# EAGLE design Clock (EAGLE 6.4)
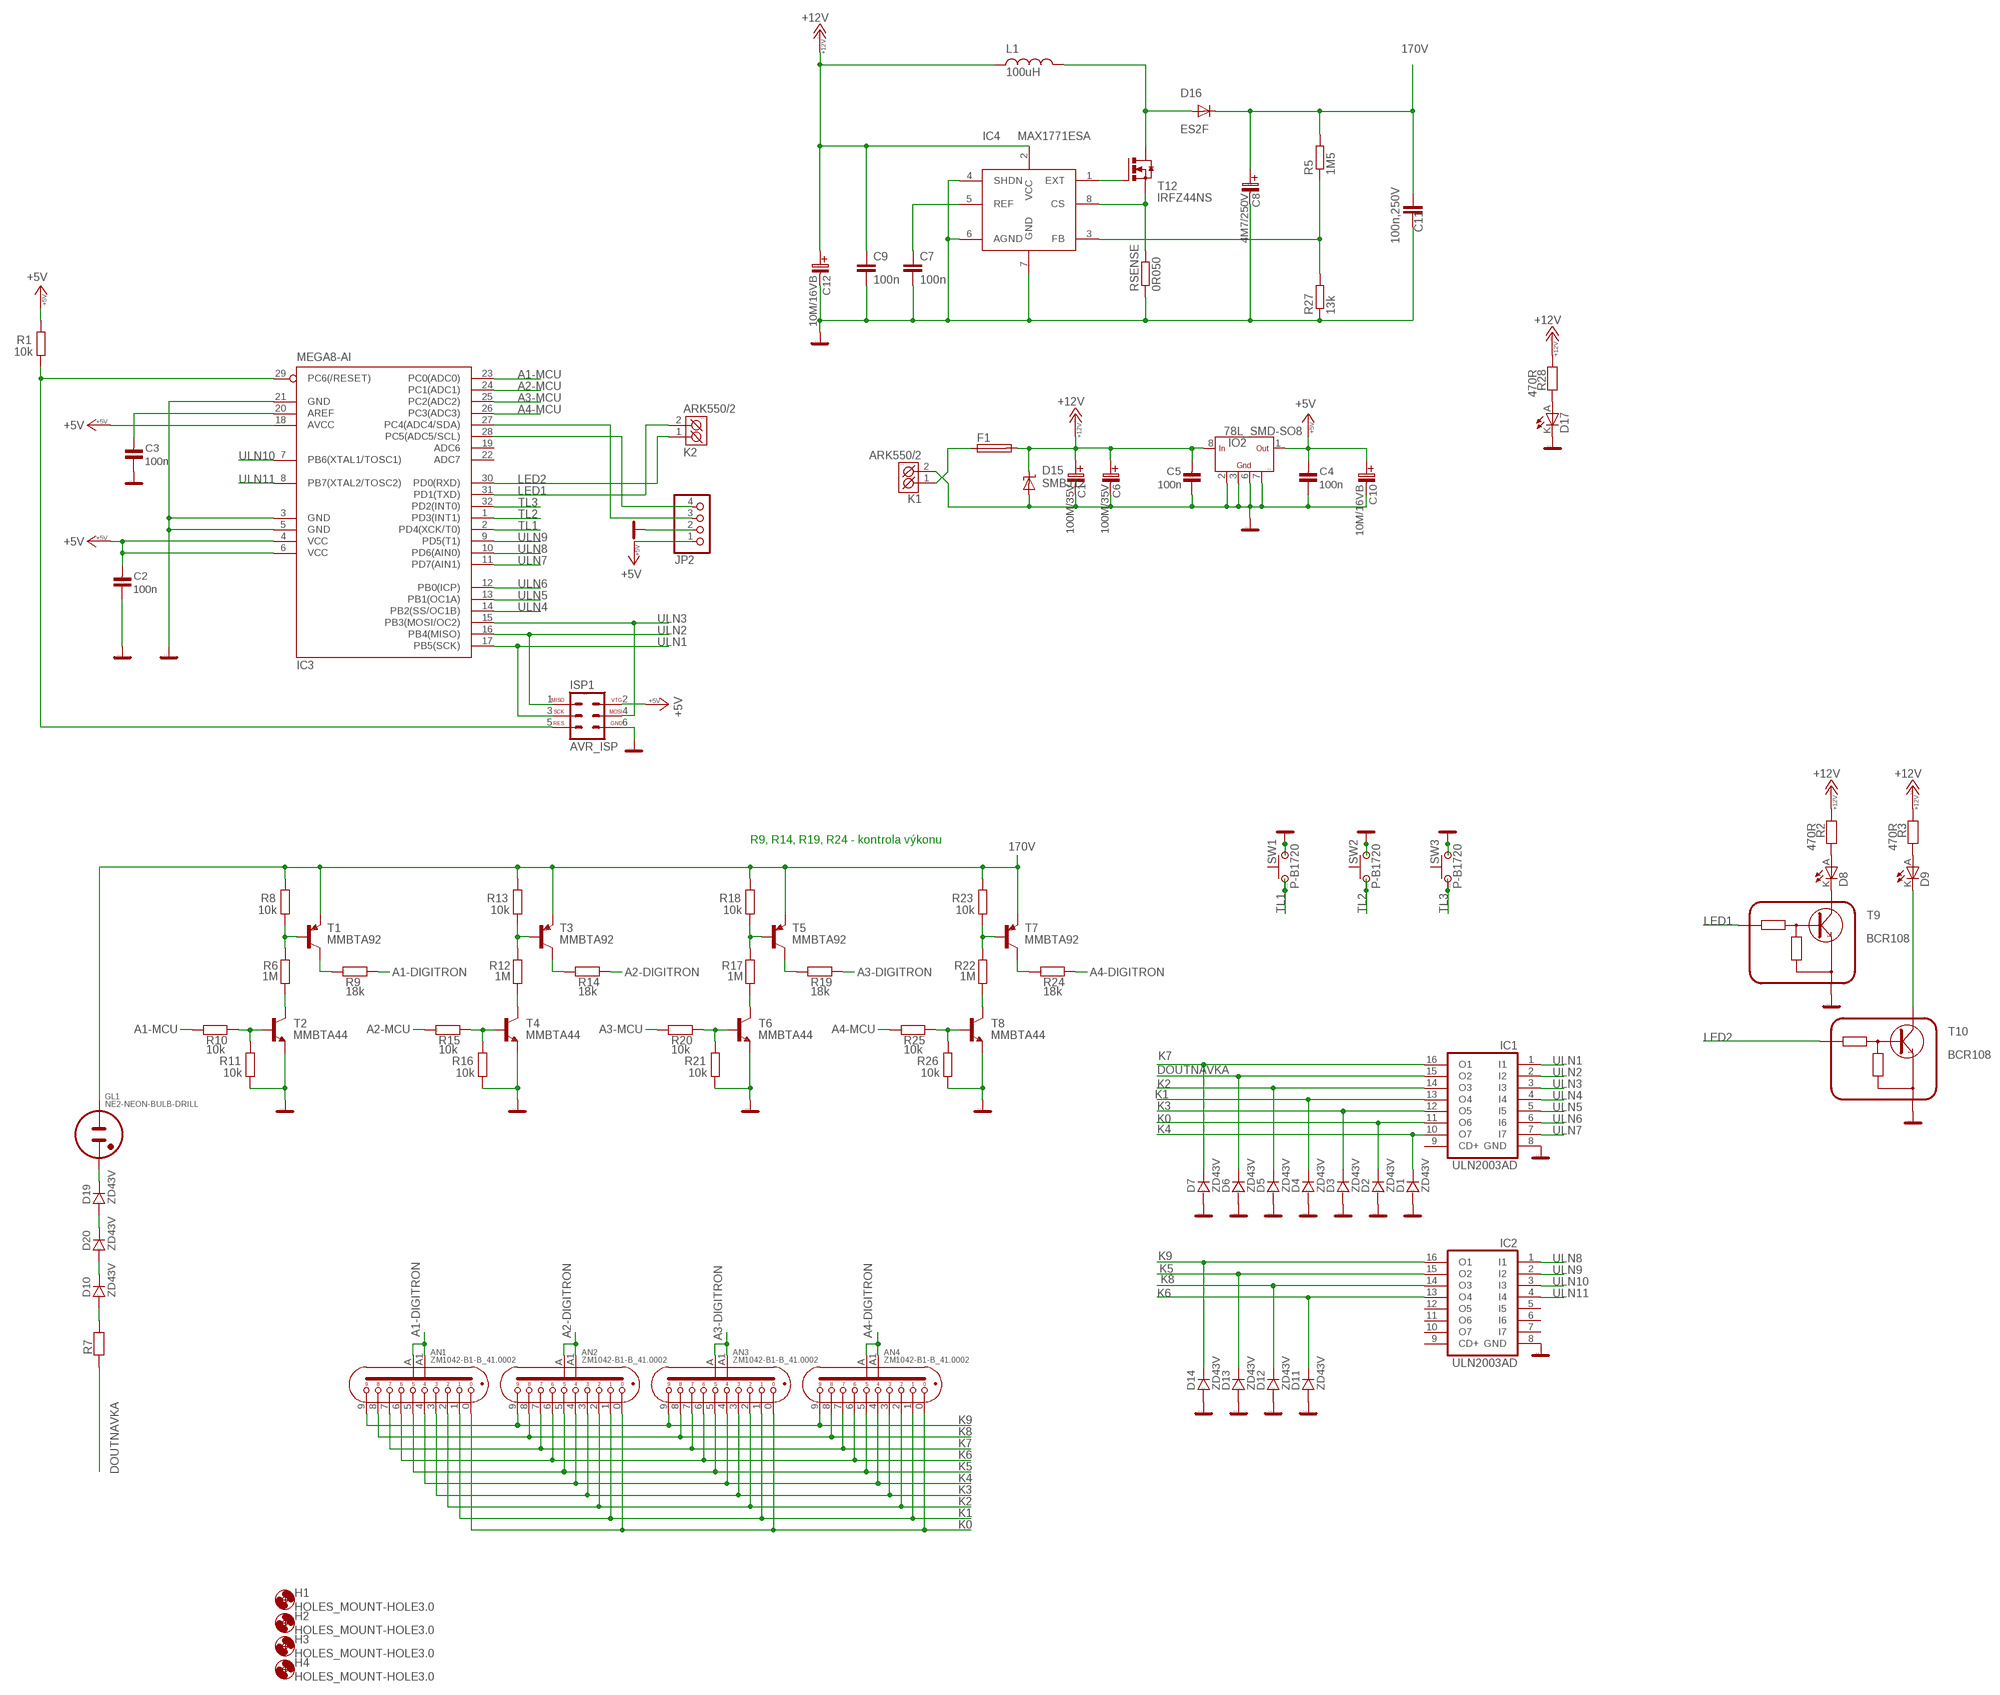
[diagram p0: schematic, sheet 1]

## Parts
AN1  ZM1042-B1-B_41.0002  [ZM1042-MULTI-CONTACT]
AN2  ZM1042-B1-B_41.0002  [ZM1042-MULTI-CONTACT]
AN3  ZM1042-B1-B_41.0002  [ZM1042-MULTI-CONTACT]
AN4  ZM1042-B1-B_41.0002  [ZM1042-MULTI-CONTACT]
C1  100M/35V  [C_EL_3,5]
C2  100n  C-KERAMIK_SMD_0805  [0805]
C3  100n  C-KERAMIK_SMD_0805  [0805]
C4  100n  C-KERAMIK_SMD_0805  [0805]
C5  100n  C-KERAMIK_SMD_0805  [0805]
C6  100M/35V  [C_EL_3,5]
C7  100n  C-EUC0805  [C0805]
C8  4M7/250V  [C_EL_3,5]
C9  100n  C-EUC0805  [C0805]
C10  10M/16VB  [B]
C11  100n,250V  C-EU-2420  [C2420]
C12  10M/16VB  [B]
D1  ZD43V  1N4148_SOD80  [SOD-80]
D2  ZD43V  1N4148_SOD80  [SOD-80]
D3  ZD43V  1N4148_SOD80  [SOD-80]
D4  ZD43V  1N4148_SOD80  [SOD-80]
D5  ZD43V  1N4148_SOD80  [SOD-80]
D6  ZD43V  1N4148_SOD80  [SOD-80]
D7  ZD43V  1N4148_SOD80  [SOD-80]
D8  LEDLED3MM  [LED3MM]
D9  LEDLED3MM  [LED3MM]
D10  ZD43V  1N4148_SOD80  [SOD-80]
D11  ZD43V  1N4148_SOD80  [SOD-80]
D12  ZD43V  1N4148_SOD80  [SOD-80]
D13  ZD43V  1N4148_SOD80  [SOD-80]
D14  ZD43V  1N4148_SOD80  [SOD-80]
D15  SMBJ12  SUPPRESSOR-SMBJ  [SMBJ]
D16  ES2F  DIODE-SMC  [SMC]
D17  LEDLED3MM  [LED3MM]
D19  ZD43V  1N4148_SOD80  [SOD-80]
D20  ZD43V  1N4148_SOD80  [SOD-80]
F1  TE5  [TE5]
GL1  NE2-NEON-BULB-DRILL  [NE2-NEON-BULB-DRILL]
H1  HOLES_MOUNT-HOLE3.0  [HOLES_3,0]
H2  HOLES_MOUNT-HOLE3.0  [HOLES_3,0]
H3  HOLES_MOUNT-HOLE3.0  [HOLES_3,0]
H4  HOLES_MOUNT-HOLE3.0  [HOLES_3,0]
IC1  ULN2003AD  [SO16]
IC2  ULN2003AD  [SO16]
IC3  MEGA8-AI  [TQFP32-08]
IC4  MAX1771ESA  [SO-8]
IO2  78L_SMD-SO8  [SO08]
ISP1  AVR_ISP  [MLW06G]
JP2  PINHD-1X4  [1X04]
K1  ARK550/2  [ARK550/2]
K2  ARK550/2  [ARK550/2]
L1  100uH  L-SMT-POWER-B82479  [L-B82479]
R1  10k  R_SMD_0805  [0805]
R2  470R  R_SMD_0805  [0805]
R3  470R  R_SMD_0805  [0805]
R5  1M5  R-EU_R0805  [R0805]
R6  1M  R_SMD_0805  [0805]
R7  W2_180K  [R__2W]
R8  10k  R_SMD_0805  [0805]
R9  18k  R_SMD_1206  [1206]
R10  10k  R_SMD_0805  [0805]
R11  10k  R_SMD_0805  [0805]
R12  1M  R_SMD_0805  [0805]
R13  10k  R_SMD_0805  [0805]
R14  18k  R_SMD_1206  [1206]
R15  10k  R_SMD_0805  [0805]
R16  10k  R_SMD_0805  [0805]
R17  1M  R_SMD_0805  [0805]
R18  10k  R_SMD_0805  [0805]
R19  18k  R_SMD_1206  [1206]
R20  10k  R_SMD_0805  [0805]
R21  10k  R_SMD_0805  [0805]
R22  1M  R_SMD_0805  [0805]
R23  10k  R_SMD_0805  [0805]
R24  18k  R_SMD_1206  [1206]
R25  10k  R_SMD_0805  [0805]
R26  10k  R_SMD_0805  [0805]
R27  13k  R-EU_R0805  [R0805]
R28  470R  R_SMD_0805  [0805]
RSENSE  0R050  R-EU_R2010  [R2010]
SW1  P-B1720  [P-B1720]
SW2  P-B1720  [P-B1720]
SW3  P-B1720  [P-B1720]
T1  MMBTA92  MMBTA92LT1-PNP-SOT23-BEC  [SOT23-BEC]
T2  MMBTA44  MMBTA42LT1-NPN-SOT23-BEC  [SOT23-BEC]
T3  MMBTA92  MMBTA92LT1-PNP-SOT23-BEC  [SOT23-BEC]
T4  MMBTA44  MMBTA42LT1-NPN-SOT23-BEC  [SOT23-BEC]
T5  MMBTA92  MMBTA92LT1-PNP-SOT23-BEC  [SOT23-BEC]
T6  MMBTA44  MMBTA42LT1-NPN-SOT23-BEC  [SOT23-BEC]
T7  MMBTA92  MMBTA92LT1-PNP-SOT23-BEC  [SOT23-BEC]
T8  MMBTA44  MMBTA42LT1-NPN-SOT23-BEC  [SOT23-BEC]
T9  BCR108  [SOT-23]
T10  BCR108  [SOT-23]
T12  IRFZ44NS  IRF3704S  [D2PACK]

## Nets
170V: C8.C+(C_EL+) C11.P$1 D16.C GL1.1(A) R5.2 R8.2 R13.2 R18.2 R23.2 T1.E T3.E T5.E T7.E
+5V: C2.2 C4.2 C10.+(C_EL+) IC3.4(VCC) IC3.6(VCC) IC3.18(AVCC) IO2.1(OUT) ISP1.2 JP2.1 R1.2
A1-DIGITRON: AN1.A1(A2) AN1.A(A1) R9.1
A1-MCU: IC3.23(PC0(ADC0)) R10.2
A2-DIGITRON: AN2.A1(A2) AN2.A(A1) R14.1
A2-MCU: IC3.24(PC1(ADC1)) R15.2
A3-DIGITRON: AN3.A1(A2) AN3.A(A1) R19.1
A3-MCU: IC3.25(PC2(ADC2)) R20.2
A4-DIGITRON: AN4.A1(A2) AN4.A(A1) R24.1
A4-MCU: IC3.26(PC3(ADC3)) R25.2
DCF: IC3.27(PC4(ADC4/SDA)) JP2.3
DOUTNAVKA: D6.K IC1.15(O2) R7.1
EXT: IC4.1(EXT) T12.1(G)
GND: C1.C-(C_EL-) C2.1 C3.1 C4.1 C5.1 C6.C-(C_EL-) C7.2 C8.C-(C_EL-) C9.2 C10.-(C_EL-) C11.P$2 C12.-(C_EL-) D1.A D2.A D3.A D4.A D5.A D6.A D7.A D11.A D12.A D13.A D14.A D15.A D17.K(C) IC1.8(GND) IC2.8(GND) IC3.3(GND) IC3.5(GND) IC3.21(GND) IC4.4(SHDN) IC4.6(AGND) IC4.7(GND) IO2.2(GND) IO2.3(GND) IO2.6(GND) IO2.7(GND) ISP1.6 JP2.2 K1.2(K2) R11.1 R16.1 R21.1 R26.1 R27.1 RSENSE.1 SW1.2 SW1.4 SW2.2 SW2.4 SW3.2 SW3.4 T2.E T4.E T6.E T8.E T9.2(E) T10.2(E)
K0: AN1.0 AN2.0 AN3.0 AN4.0 D2.K IC1.11(O6)
K1: AN1.1 AN2.1 AN3.1 AN4.1 D4.K IC1.13(O4)
K2: AN1.2 AN2.2 AN3.2 AN4.2 D5.K IC1.14(O3)
K3: AN1.3 AN2.3 AN3.3 AN4.3 D3.K IC1.12(O5)
K4: AN1.4 AN2.4 AN3.4 AN4.4 D1.K IC1.10(O7)
K5: AN1.5 AN2.5 AN3.5 AN4.5 D13.K IC2.15(O2)
K6: AN1.6 AN2.6 AN3.6 AN4.6 D11.K IC2.13(O4)
K7: AN1.7 AN2.7 AN3.7 AN4.7 D7.K IC1.16(O1)
K8: AN1.8 AN2.8 AN3.8 AN4.8 D12.K IC2.14(O3)
K9: AN1.9 AN2.9 AN3.9 AN4.9 D14.K IC2.16(O1)
LED1: IC3.31(PD1(TXD)) K2.2(K2) T9.1(B)
LED2: IC3.30(PD0(RXD)) K2.1(K1) T10.1(B)
LED3: IC3.28(PC5(ADC5/SCL)) JP2.4
N$1: C3.2 IC3.20(AREF)
N$3: C1.C+(C_EL+) C5.2 C6.C+(C_EL+) C9.1 C12.+(C_EL+) D15.C F1.2 IC4.2(VCC) IO2.8(IN) L1.P$1 R2.2 R3.2 R28.2 ; supply symbol labelled +12V
N$4: F1.1 K1.1(K1)
N$5: D8.K(C) T9.3(C)
N$6: D9.K(C) T10.3(C)
N$7: D10.A R7.2
N$8: D8.A R2.1
N$9: D9.A R3.1
N$10: D10.K D20.A
N$11: D19.K GL1.2(A1)
N$12: IC4.3(FB) R5.1 R27.2
N$13: C7.1 IC4.5(REF)
N$15 [power]: D16.A L1.P$2 T12.2(D)
N$16: IC4.8(CS) RSENSE.2 T12.3(S)
N$17: IC3.29(PC6(/RESET)) ISP1.5 R1.1
N$23: D19.A D20.K
N$28: D17.A R28.1
N$51: R6.2 R8.1 T1.B
N$52: R9.2 T1.C
N$53: R6.1 T2.C
N$55: R10.1 R11.2 T2.B
N$56: R12.2 R13.1 T3.B
N$57: R14.2 T3.C
N$58: R12.1 T4.C
N$59: R15.1 R16.2 T4.B
N$60: R17.2 R18.1 T5.B
N$61: R19.2 T5.C
N$62: R17.1 T6.C
N$63: R20.1 R21.2 T6.B
N$64: R22.2 R23.1 T7.B
N$65: R24.2 T7.C
N$66: R22.1 T8.C
N$67: R25.1 R26.2 T8.B
TL1: IC3.2(PD4(XCK/T0)) SW1.1 SW1.3
TL2: IC3.1(PD3(INT1)) SW2.1 SW2.3
TL3: IC3.32(PD2(INT0)) SW3.1 SW3.3
ULN1: IC1.1(I1) IC3.17(PB5(SCK)) ISP1.3
ULN2: IC1.2(I2) IC3.16(PB4(MISO)) ISP1.1
ULN3: IC1.3(I3) IC3.15(PB3(MOSI/OC2)) ISP1.4
ULN4: IC1.4(I4) IC3.14(PB2(SS/OC1B))
ULN5: IC1.5(I5) IC3.13(PB1(OC1A))
ULN6: IC1.6(I6) IC3.12(PB0(ICP))
ULN7: IC1.7(I7) IC3.11(PD7(AIN1))
ULN8: IC2.1(I1) IC3.10(PD6(AIN0))
ULN9: IC2.2(I2) IC3.9(PD5(T1))
ULN10: IC2.3(I3) IC3.7(PB6(XTAL1/TOSC1))
ULN11: IC2.4(I4) IC3.8(PB7(XTAL2/TOSC2))
Unconnected: IC1.9(CD+) IC2.5(I5) IC2.6(I6) IC2.7(I7) IC2.9(CD+) IC2.10(O7) IC2.11(O6) IC2.12(O5) IC3.19(ADC6) IC3.22(ADC7) IO2.4 IO2.5

## Notes on the sheet
- R9, R14, R19, R24 - kontrola výkonu

## Library data of the parts
AN1-AN4 = nixie_tube:ZM1042: Indicator Tube (numeral height 30mm, no filter, side view, long-life typ)
C1 C6 = #PaJa_C-el_2:100M/35V
C2-C5 = #PaJa_22:C-KERAMIK: Kondenzator - keramicky
C7 C9 = rcl:C-EU: CAPACITOR, European symbol
C8 = #PaJa_C-el_2:4M7/250V
C10 C12 = #PaJa_C-tantal_SMD:10M/16V
C11 = nick:C-EU
D1-D7 D10-D14 D19 D20 = #PaJa_30:1N4148: Univerzalni dioda - 0,15A, 75V
D8 D9 D17 = #Led:LED
D15 = diode:SUPPRESSOR-: Suppressor diode
D16 = diode:DIODE-: DIODE
F1 = fuse:TE5: FUSE Wickmann; OC_FARNELL: unknown; OC_NEWARK: unknown
GL1 = nixie_tube:NE2-NEON-BULB: Neon indicator (wire connection)
H1-H4 = R-uzky-otoceny:HOLES_MOUNT-HOLE: MOUNTING HOLE with drill center marker
IC1 IC2 = uln-udn:ULN2003A: DRIVER ARRAY
IC3 = atmel:MEGA8: MICROCONTROLLER 8 Kbytes FLASH, 1 kbytes SRAM, 512 bytes EEPROM, USART, 6-channel 10 bit ADC, 2-channel 8 bit ADC Pin compatible with Atmega48, ATMega88, ATMega168 Source: avr.lbr; MPN: ATMEGA8-16AU; OC_FARNELL: 9171371; OC_NEWARK: 73M8863
IC4 = nick:MAX1771
IO2 = #PaJa_30:78L??_SMD-SO8: Stabilizátor SMD - 100mA ?? - napeti => 05, 08, 09, 12, 15
ISP1 = #PaJa_30:AVR_ISP: AVR ISP konektor (dle standardu)
JP2 = pinhead:PINHD-1X4: PIN HEADER
K1 K2 = #PaJa_konektory:ARK550/2: Svorkovnice - roztec 3,5mm - dvojita
L1 = nick:L-SMT-POWER: SMT power inductors
R1 R6 R8 R11-R13 R16-R18 R21-R23 R26 = #PaJa_22:R: Rezistor
R2 R3 R9 R10 R14 R15 R19 R20 R24 R25 R28 = #PaJa_30:R: Rezistor
R5 R27 RSENSE = rcl:R-EU_: RESISTOR, European symbol
R7 = #PaJa_R:W2_180K
SW1-SW3 = #PaJa_prepinace:P-B1720: µ-tlacitko
T1 T3 T5 T7 = transistor:*-PNP-: PNP Transistror
T2 T4 T6 T8 = transistor:*-NPN-: NPN Transistror BF959 corrected 2008.03.06
T9 T10 = #PaJa_30:BCR108
T12 = transistor-power:IRF3704: SMPS MOSFET HEXFET® Power MOSFET Source: http://www.irf.com/product-info/datasheets/data/irf3704.pdf

## Net classes
1 power: width 0.762 mm, clearance 0.508 mm

## Board
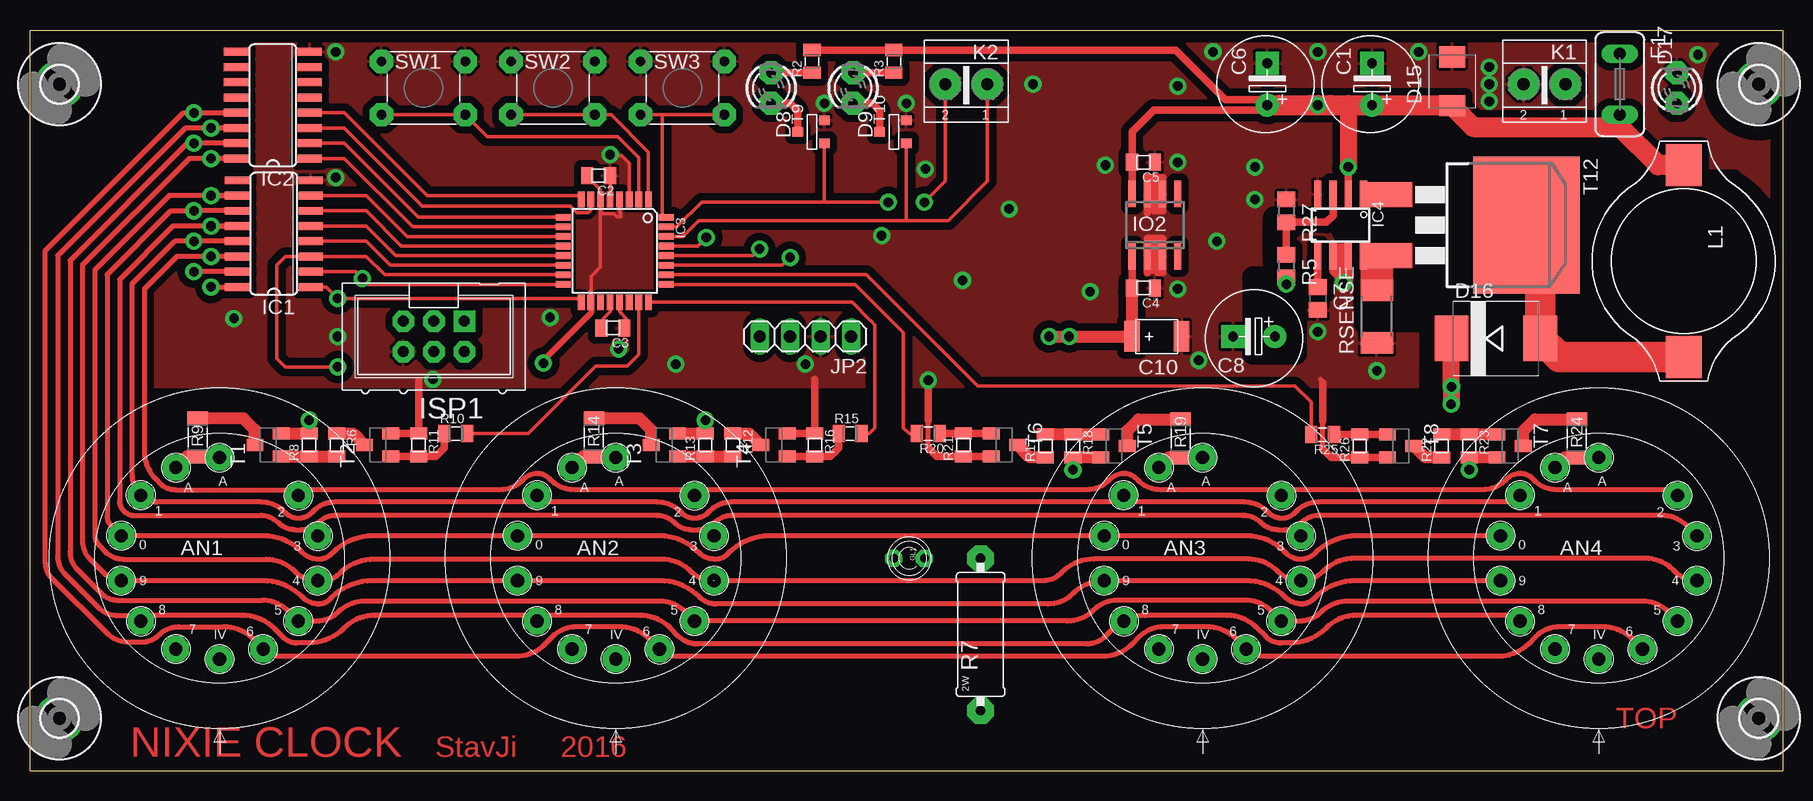
[diagram p1: board, top side]
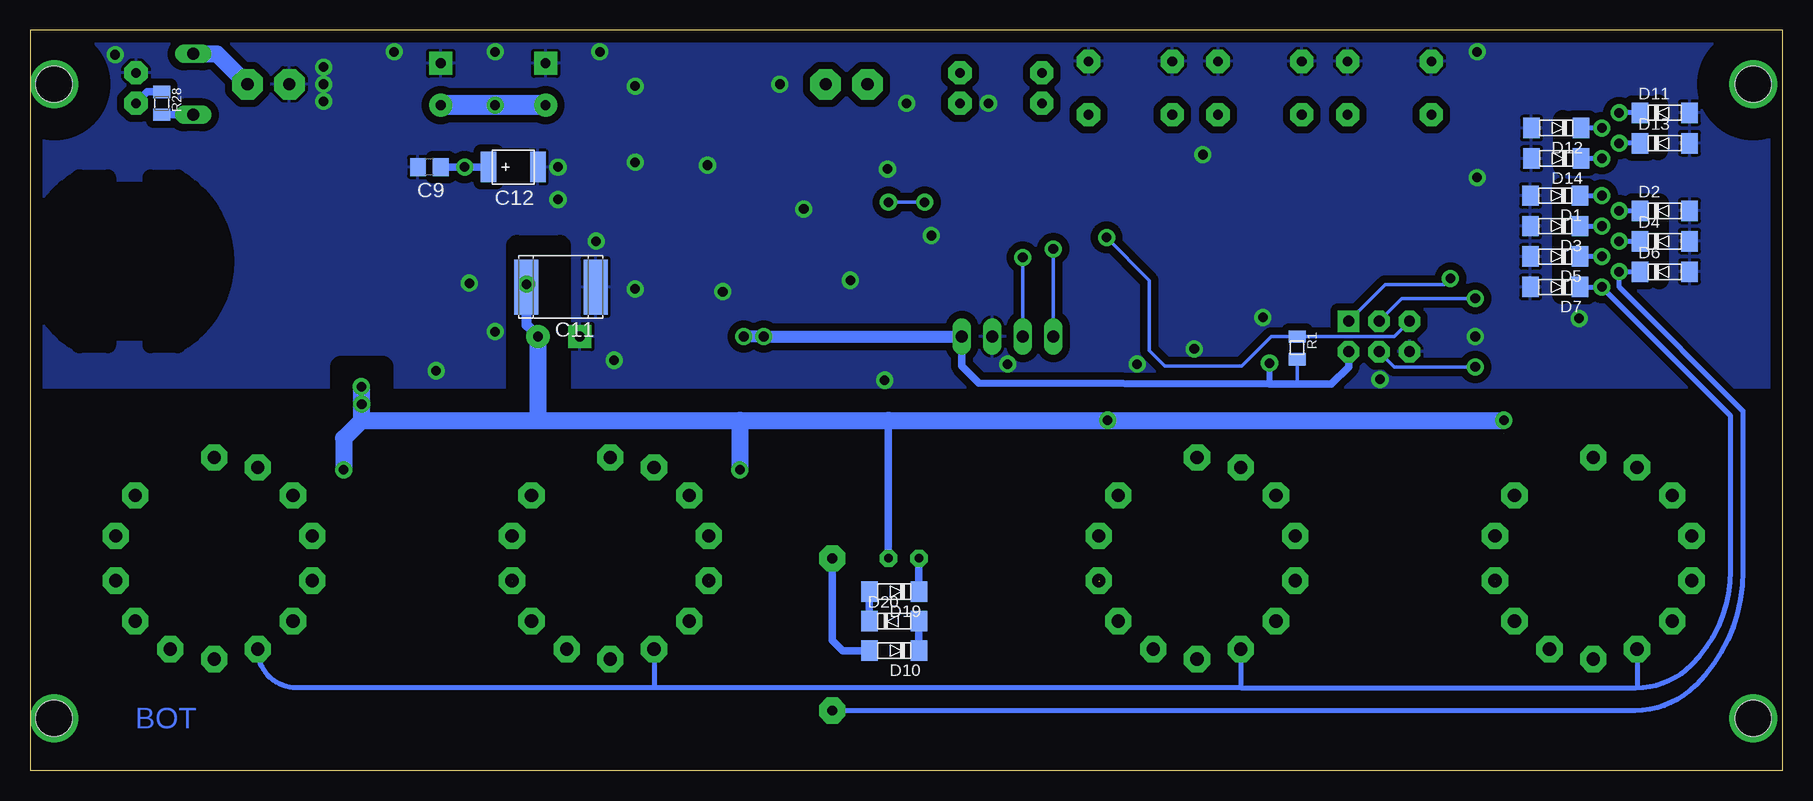
[diagram p2: board, bottom side, seen from below]

Size 146.05 x 61.75 mm. Coordinates in mm from the lower left corner, seen from the top.
Outline: 0,0 146.05,0 146.05,61.75 0,61.75 0,0
Copper layers (1*16): Top 0.035mm / dielectric 1.5mm / Bottom 0.035mm
Design rules "default": minimum track width 10mil, minimum drill 24mil, track to track 8mil, track to pad 8mil, pad to pad 8mil, via to via 8mil, smd to smd 8mil, copper to edge 40mil, drill to drill 8mil, minimum pad ring 10mil, minimum via ring 8mil, stop-mask expansion 4mil, vias tented up to drill 0mil, thermal gap 10mil
tRestrict: 19 lines
bRestrict: 14 lines

### Footprints (pad centres in the part's own frame; a part is rotated, then mirrored left to right if it is on the bottom)
ZM1042-MULTI-CONTACT = drill 1.1 pad 2.184 octagon: 0 -8.189,1.869; 1 -6.567,5.237; 2 6.567,5.237; 3 8.189,1.869; 4 8.189,-1.869; 5 6.567,-5.237; 6 3.645,-7.568; 7 -3.645,-7.568; 8 -6.567,-5.237; 9 -8.189,-1.869; A 0,8.4; A1 -3.645,7.568; IV 0,-8.4
C_EL_3,5 = drill 0.813 pad 1.93: C+ 0,0 | drill 0.813 pad 1.93 square: C- 3.493,0
0805 = smd 1.016 x 1.422: 1 -0.953,0; 2 0.953,0
C0805 = smd 1.3 x 1.5: 1 -0.95,0; 2 0.95,0
B = smd 1.27 x 2.54: + 2.223,0; - -1.905,0
C2420 = smd 2 x 4.6: P$1 2.9,0; P$2 -2.9,0
SOD-80 = smd 1.397 x 1.702: A 1.905,0; K -2.223,0
LED3MM = drill 0.8 pad 1.93 octagon: A -1.27,0; K 1.27,0
SMBJ = smd 1.78 x 2.16: A 2.04,0; C -2.03,0
SMC = smd 2.8 x 3.8: A 3.7,0; C -3.7,0
TE5 = drill 1.016 long: 1 -2.54,0; 2 2.54,0
NE2-NEON-BULB-DRILL = drill 0.7 pad 1.422 octagon: 1 0,1.27; 2 0,-1.27
HOLES_3,0 = hole 3: 0,0
SO16 = smd 0.66 x 2.032: 1 -4.445,-3.073; 2 -3.175,-3.073; 3 -1.905,-3.073; 4 -0.635,-3.073; 5 0.635,-3.073; 6 1.905,-3.073; 7 3.175,-3.073; 8 4.445,-3.073; 9 4.445,3.073; 10 3.175,3.073; 11 1.905,3.073; 12 0.635,3.073; 13 -0.635,3.073; 14 -1.905,3.073; 15 -3.175,3.073; 16 -4.445,3.073
TQFP32-08 = smd 1.27 x 0.559: 1 -4.293,2.8; 2 -4.293,2; 3 -4.293,1.2; 4 -4.293,0.4; 5 -4.293,-0.4; 6 -4.293,-1.2; 7 -4.293,-2; 8 -4.293,-2.8; 17 4.293,-2.8; 18 4.293,-2; 19 4.293,-1.2; 20 4.293,-0.4; 21 4.293,0.4; 22 4.293,1.2; 23 4.293,2; 24 4.293,2.8 | smd 0.559 x 1.27: 9 -2.8,-4.293; 10 -2,-4.293; 11 -1.2,-4.293; 12 -0.4,-4.293; 13 0.4,-4.293; 14 1.2,-4.293; 15 2,-4.293; 16 2.8,-4.293; 25 2.8,4.293; 26 2,4.293; 27 1.2,4.293; 28 0.4,4.293; 29 -0.4,4.293; 30 -1.2,4.293; 31 -2,4.293; 32 -2.8,4.293
SO-8 = smd 0.6 x 2.2: 1 -1.905,-2.6; 2 -0.635,-2.6; 3 0.635,-2.6; 4 1.905,-2.6; 5 1.905,2.6; 6 0.635,2.6; 7 -0.635,2.6; 8 -1.905,2.6
SO08 = smd 0.6 x 2.2: 1 -1.905,-2.6; 2 -0.635,-2.6; 3 0.635,-2.6; 4 1.905,-2.6; 5 1.905,2.6; 6 0.635,2.6; 7 -0.635,2.6; 8 -1.905,2.6
MLW06G = drill 0.914 pad 1.778 square: 1 -2.54,-1.27 | drill 0.914 pad 1.778 octagon: 2 -2.54,1.27; 3 0,-1.27; 4 0,1.27; 5 2.54,-1.27; 6 2.54,1.27
1X04 = drill 1.016 long: 1 -3.81,0; 2 -1.27,0; 3 1.27,0; 4 3.81,0
ARK550/2 = drill 1.016 pad 2.54 octagon: 1 0,0; 2 3.493,0
L-B82479 = smd 3.5 x 3: P$1 -8,0; P$2 8,0
R0805 = smd 1.3 x 1.5: 1 -0.95,0; 2 0.95,0
R__2W = drill 0.813 pad 2.184 octagon: 1 -6.35,0; 2 6.35,0
1206 = smd 1.143 x 1.702: 1 -1.587,0; 2 1.587,0
R2010 = smd 1.8 x 2.7: 1 -2.2,0; 2 2.2,0
P-B1720 = drill 0.813 pad 1.93 octagon: 1 -3.493,-2.223; 2 -3.493,2.223; 3 3.493,-2.223; 4 3.493,2.223
SOT23-BEC = smd 1 x 1.4: B -0.95,-1.1; C 0,1.1; E 0.95,-1.1
SOT-23 = smd 0.787 x 0.889: 1 -0.953,-0.953; 2 0.953,-0.953; 3 0,1.27
D2PACK = smd 2.083 x 3.81: 1 -2.54,-8.89; 3 2.54,-8.89 | smd 11.43 x 8.89: 2 0,2.54

### Placement (x,y rotation side)
AN1  15.8,17.7 0 top
AN2  48.82,17.7 0 top
AN3  97.71,17.7 0 top
AN4  130.73,17.7 0 top
C1  111.84,55.48 90 top
C2  47.39,49.61 180 top
C3  48.58,36.91 180 top
C4  92.79,40.24 180 top
C5  92.79,50.72 180 top
C6  103.11,55.48 90 top
C7  107.31,39.37 270 top
C8  103.74,36.2 180 top
C9  112.79,50.32 180 bottom
C10  94.06,36.2 180 top
C11  101.84,40.32 180 bottom
C12  105.65,50.32 180 bottom
D1  19.13,47.94 180 bottom
D2  9.68,46.67 0 bottom
D3  19.13,45.4 180 bottom
D4  9.68,44.13 0 bottom
D5  19.13,42.86 180 bottom
D6  9.68,41.59 0 bottom
D7  19.13,40.32 180 bottom
D8  61.75,56.91 270 top
D9  68.58,56.91 270 top
D10  74.22,10 180 bottom
D11  9.68,54.85 0 bottom
D12  19.05,53.58 180 bottom
D13  9.68,52.31 0 bottom
D14  19.05,51.04 180 bottom
D15  118.51,57.47 90 top
D16  122.16,36.04 0 top
D17  137.24,56.91 90 top
D19  74.22,14.92 180 bottom
D20  73.9,12.46 0 bottom
F1  132.48,57.23 270 top
GL1  73.26,17.7 270 top
H1  2.46,4.37 0 top
H2  144.07,4.37 0 top
H3  144.07,57.23 0 top
H4  2.46,57.23 0 top
IC1  20.32,44.77 90 top
IC2  20.24,55.48 90 top
IC3  48.74,43.34 270 top
IC4  109.22,45.48 180 top
IO2  78L?_SMD-SO8  [SO08]  93.74,45.48 0 top
ISP1  33.66,36.2 180 top
JP2  64.61,36.2 180 top
K1  127.95,57.23 180 top
K2  79.77,57.23 180 top
L1  137.79,42.47 270 top
R1  40.48,35.24 270 bottom
R2  65.17,59.13 90 top
R3  71.99,59.13 90 top
R5  104.7,42.07 270 top
R6  25.56,27.15 270 top
R7  79.22,11.35 90 top
R8  23.26,27.15 90 top
R9  13.97,27.78 90 top
R10  35.48,28.1 0 top
R11  32.38,27.15 270 top
R12  58.58,27.15 270 top
R13  56.28,27.15 90 top
R14  46.99,27.78 90 top
R15  68.34,28.1 0 top
R16  65.41,27.15 270 top
R17  84.61,27.07 90 top
R18  86.92,27.07 270 top
R19  95.89,27.7 90 top
R20  74.85,28.1 180 top
R21  77.79,27.15 90 top
R22  117.63,27.07 90 top
R23  119.94,27.07 270 top
R24  128.91,27.7 90 top
R25  107.71,28.02 180 top
R26  110.81,27.07 90 top
R27  104.7,46.67 270 top
R28  135.1,55.64 270 bottom
RSENSE  112.24,37.86 90 top
SW1  32.78,56.91 0 top
SW2  43.58,56.91 0 top
SW3  54.37,56.91 0 top
T1  19.84,27.15 90 top
T2  28.97,27.15 90 top
T3  52.86,27.15 90 top
T4  61.99,27.15 90 top
T5  90.33,27.07 270 top
T6  81.2,27.15 270 top
T7  123.35,27.07 270 top
T8  114.22,27.07 270 top
T9  65.25,53.26 90 top
T10  72.07,53.26 90 top
T12  122.16,45.48 270 top

### Tracks (layer width: path | path; a pad name or v marks a point on that pad's centre or on a via)
170V  (via drill 0.8 pad 1.42)  (1 unrouted)
  Top 0.61: T5.E | R5.2 v104.7,40.56
  Top 1.016: T5.E R18.2 v86.92,25.08 | T7.E R23.2 v119.94,25.08 | T3.E R13.2 v56.28,29.21 | T1.E R8.2 | v23.26,29.21 R8.2
  Top 1.422: 118.43,32.05 v118.43,30.56 | 118.46,35.27 118.43,35.24 118.43,34.77 | 118.43,32.05 v118.46,32.02 | 118.43,32.05 118.43,34.77 | D16.C 118.46,34.8 118.43,34.77
  Bottom 0.305: C11.P$1 104.7,40.37 v104.7,40.56
  Bottom 0.61: GL1.1 74.53,29.21
  Bottom 0.813: C8.C+ 104.7,37.15 v104.7,40.56
  Bottom 1.422: 118.43,29.21 103.74,29.21 | 103.74,29.21 86.92,29.21 | 86.92,29.21 74.53,29.21 v56.28,29.21 v23.26,29.21 | v118.46,32.02 118.46,30.59 v118.43,30.56 118.43,29.21 | 86.92,29.21 v86.92,25.08 | C8.C+ 103.74,29.21 | 118.43,29.21 119.94,27.7 v119.94,25.08
+5V  (via drill 0.8 pad 1.42)
  Top 0.305: 46.75,40.01 46.74,39.99 IC3.18 46.75,39.06 46.75,41.2 47.54,41.98 47.54,46.68 | IC3.6 47.54,46.68 | 47.54,46.68 47.55,46.67 | IC3.4 49.14,46.52 | 49.14,46.52 49.13,46.83 | IC3.6 47.54,47.93 | 47.54,47.93 47.55,47.94 | IC3.6 47.54,46.6 47.55,46.59 47.55,46.51 47.62,46.43 48.66,46.43 48.9,46.2 49.21,46.2 49.21,46.44 49.14,46.52 | 47.54,47.93 47.54,48.43 46.43,49.53 C2.2
  Top 0.508: IC3.18 46.75,39.03 46.75,38.18 42.78,34.21 v42.78,33.97
  Top 0.61: IO2.1 C4.2
  Top 1.016: C4.2 91.84,39.89 91.8,39.93 91.8,36.79 C10.+ v84.93,36.2
  Bottom 0.305: R1.2 40.48,32.23
  Bottom 0.508: v42.78,33.97 42.78,32.23
  Bottom 0.61: ISP1.2 36.2,33.66 37.62,32.23 40.48,32.23 42.78,32.23 66.99,32.31 68.42,33.73 JP2.1
  Bottom 1.016: v86.6,36.2 v84.93,36.2 JP2.1
  pour Top (isolate 0.406): 45.24,46.83 52.23,46.83 52.23,39.85 45.24,39.85
A1-DIGITRON
  Top 1.016: AN1.A1 13.08,26.19 R9.1 15.88,26.19 15.8,26.11 AN1.A
A1-MCU
  Top 0.305: IC3.23 50.74,34.7 49.77,33.73 47.15,33.73 41.51,28.1 R10.2
A2-DIGITRON
  Top 1.016: AN2.A1 46.1,26.19 R14.1 48.82,26.19 AN2.A
A2-MCU
  Top 0.305: IC3.24 68.51,39.05 69.89,37.66 70.09,37.47 70.41,37.15 70.41,28.57 69.93,28.1 R15.2
A3-DIGITRON
  Top 1.016: AN3.A 97.7,26.11 R19.1 94.91,26.11 AN3.A1
A3-MCU
  Top 0.305: IC3.25 68.76,40.54 72.79,36.51 72.79,28.57 73.26,28.1 R20.2
A4-DIGITRON
  Top 1.016: AN4.A 130.72,26.11 R24.1 127.93,26.11 AN4.A1
A4-MCU
  Top 0.305: IC3.26 69.71,41.34 78.98,32.07 105.41,32.07 106.76,30.72 R25.2
DCF  (via drill 0.8 pad 1.42)
  Top 0.305: IC3.27 62.7,42.14 v63.34,42.78
  Bottom 0.305: JP2.3 v63.34,42.78
DOUTNAVKA  (via drill 0.8 pad 1.42)
  Top 0.406: IC1.15 v13.65,41.59
  Bottom 0.406: D6.K v13.65,41.59 13.65,40.32 3.33,30 3.33,16.59 arc45 7.27,7.1 arc45 12.34,5 R7.1
EXT
  Top 0.61: IC4.1 113.21,48.08 T12.1
GND  (via drill 0.8 pad 1.42)
  Top 0.305: IC3.3 49.94,48.89 | 49.94,48.89 49.93,48.9 | IC3.5 48.34,49.05 48.34,48.82 | 49.94,48.89 49.94,50.63 49.29,51.28 48.42,51.28 v48.34,51.36 | IC3.21 49.14,38.26 49.69,37.7 49.69,37.07 C3.1
  Top 0.406: 74.85,26.99 74.85,29.21 | 107.71,26.91 107.71,29.13 | 107.71,32.31 107.55,32.62
  Top 0.61: T2.E 30.39,28.1 R11.1 32.38,32.46 | T4.E R16.1 65.41,32.62 | T6.E R21.1 | R21.1 | T8.E R26.1 | R26.1 | R21.1 75.56,26.2 74.85,26.91 74.85,26.99 | R26.1 108.42,26.12 107.71,26.83 107.71,26.91 | 107.71,32.31 107.71,29.13 | 74.85,29.21 v74.85,32.54 | 108.58,42.86 108.58,41.59 109.22,40.96 109.93,40.96 109.93,41.12 109.86,41.2 109.86,43.66 108.66,43.66 108.66,43.1 109.54,43.1 109.54,41.75 109.46,41.67 109.06,41.67 109.06,42.7 | 93.11,41.51 93.11,44.37 94.38,44.37 94.38,41.51 93.98,41.51 93.98,43.18 | 93.98,43.18 93.5,43.18 93.5,41.75 | 93.5,44.05 93.5,43.5 93.98,43.5 | 93.98,43.5 93.98,44.05 | 93.98,43.5 93.98,43.18 | 93.11,46.51 93.11,49.45 94.38,49.45 94.38,46.67 93.66,46.67 93.66,49.05 94.06,49.05 94.06,47.07 93.98,46.99
  other vias: 107.31,36.59 112.24,33.34 109.46,40.64 97.39,34.21 98.9,44.13 102.08,50.32 95.65,50.72 102.08,47.62 107.31,59.93 98.58,59.93 115.73,59.93 66.2,55.64 73.03,55.64 83.58,57.23 49.05,35.16 25.48,49.45 25.48,59.93 64.61,33.89 33.58,32.62 43.34,37.78 95.65,57.07 25.64,36.2 16.99,37.7 138.99,59.69 53.82,33.89 95.65,40.16 89.61,50.48 121.6,57.23 121.6,55.8 121.6,58.66 70.96,44.61 81.6,46.83 77.71,40.88 88.34,39.93 74.61,50.16
  pour Top (isolate 0.61, rank 6): -2.06,61.75 148.51,61.75 148.51,31.99 -2.06,31.99
  pour Bottom (isolate 0.61, rank 6): -2.38,62.07 148.91,62.07 148.83,31.99 -2.46,31.99
K0  (via drill 0.8 pad 1.42)
  Top 0.406: AN4.0 110.5,19.57 arc45 107.17,18.19 107.12,18.14 arc-45 105.86,17.62 arc-45 104.68,18.11 104.52,18.27 arc45 101.39,19.57 AN3.0 61.65,19.57 arc45 58.25,18.16 58.12,18.04 arc-45 57.12,17.62 arc-45 55.68,18.22 55.62,18.28 arc45 52.5,19.57 AN2.0 28.56,19.57 arc45 25.27,18.2 25.12,18.06 arc-45 24.07,17.62 24.03,17.62 arc-45 22.71,18.17 22.62,18.26 arc45 19.45,19.57 AN1.0 | AN1.0 7.54,19.57 | AN1.0 6.77,20.41 arc-45 6.43,21.23 6.43,41.35 11.75,46.67 v13.65,46.67 IC1.11
  Bottom 0.406: v13.65,46.67 D2.K
K1  (via drill 0.8 pad 1.42)
  Top 0.406: AN4.1 124.16,22.38 107.37,22.38 arc45 105.52,21.61 105.34,21.44 arc-45 104.36,21.03 arc-45 103.17,21.52 103.1,21.6 arc45 101.21,22.38 91.14,22.38 | 91.14,22.38 58.44,22.38 arc45 56.64,21.64 56.52,21.51 arc-45 55.36,21.03 arc-45 54.35,21.45 54.24,21.57 arc45 52.26,22.38 42.25,22.38 | 42.25,22.38 25.39,22.38 arc45 23.65,21.66 23.48,21.49 arc-45 22.37,21.03 arc-45 21.31,21.48 21.2,21.58 arc45 19.27,22.38 10.57,22.38 arc-45 AN1.1 arc-45 8.49,24.71 8.49,40.56 12.06,44.13 IC1.13 v13.65,44.13 | AN2.1 42.25,22.38 | AN3.1 91.14,22.38
  Bottom 0.406: v13.65,44.13 D4.K
K2  (via drill 0.8 pad 1.42)
  Top 0.406: AN4.2 137.3,23.42 127.21,23.42 arc-45 125.36,24.18 125.19,24.36 arc45 124.2,24.77 arc45 123.02,24.28 122.95,24.21 arc-45 121.03,23.42 104.3,23.42 | 104.3,23.42 94.19,23.42 arc-45 92.34,24.18 92.16,24.36 arc45 91.18,24.77 arc45 90,24.27 89.91,24.18 arc-45 88.05,23.42 55.4,23.42 | 55.4,23.42 45.33,23.42 arc-45 43.42,24.21 43.25,24.38 arc45 42.31,24.77 arc45 41.08,24.26 41,24.17 arc-45 39.17,23.42 22.23,23.42 | 22.23,23.42 12.11,23.42 arc-45 10.81,23.95 10.5,24.26 arc-45 9.53,26.62 9.53,40.16 12.22,42.86 IC1.14 v15.08,42.86 | AN3.2 104.28,23.39 104.3,23.42 | AN2.2 55.38,23.39 55.4,23.42 | AN1.2 22.36,23.28 22.23,23.42
  Bottom 0.406: v15.08,42.86 D5.K
K3  (via drill 0.8 pad 1.42)
  Top 0.406: AN4.3 138.09,20.39 arc45 135.98,21.27 107.47,21.27 arc45 105.88,20.63 105.83,20.59 | 105.83,20.59 arc-45 104.6,20.08 103.96,20.08 arc-45 102.64,20.63 arc45 101.08,21.27 58.6,21.27 arc45 57.04,20.68 57.03,20.68 | AN3.3 105.9,19.59 105.33,20.16 105.83,20.59 | 57.03,20.68 arc-45 55.7,20.08 55.08,20.08 arc-45 53.73,20.64 53.73,20.65 arc45 52.22,21.27 25.56,21.27 arc45 24.07,20.72 24.01,20.66 | 57.03,20.68 56.98,20.62 56.52,20.24 AN2.3 | 24.01,20.66 arc-45 22.61,20.08 22.05,20.08 arc-45 20.72,20.63 arc45 19.18,21.27 8.7,21.27 arc-45 7.8,21.64 arc-45 7.46,22.47 7.46,40.96 11.91,45.4 IC1.12 v15.08,45.4 | AN1.3 23.98,19.59 23.42,20.16 23.42,20.24 24.01,20.66
  Bottom 0.406: D3.K v15.08,45.4
K4  (via drill 0.8 pad 1.42)  (3 unrouted)
  Top 0.406: AN4.4 arc-45 137.07,16.6 136.95,16.72 arc45 134.59,17.7 110.41,17.7 arc45 107.72,16.59 arc-45 AN3.4 arc-45 103.92,16.65 arc45 101.55,17.64 88.66,17.64 arc45 85.98,16.52 85.87,16.42 arc-45 84.45,15.83 56.95,15.83 arc-45 55.07,16.61 arc45 52.62,17.62 28.67,17.62 arc45 25.8,16.43 arc-45 24.35,15.83 AN1.4 arc-45 22.01,16.65 arc45 19.66,17.62 7.8,17.62 arc-45 6.28,18.25 5.77,18.76 arc-45 5.4,19.66 5.4,41.75 11.59,47.94 IC1.10 v15.08,47.94
  Bottom 0.406: D1.K v15.08,47.94
K5  (via drill 0.8 pad 1.42)
  Top 0.406: AN4.5 136.51,13.25 arc45 134.39,14.13 109.82,14.13 arc45 107.57,13.2 arc-45 105.8,12.46 104.36,12.46 AN3.5 103.41,13.33 arc45 101.29,14.21 90.64,14.21 arc45 88.62,13.37 arc-45 86.43,12.46 AN2.5 54.6,13.25 arc45 52.47,14.13 27.91,14.13 arc45 25.66,13.2 arc-45 23.88,12.46 22.38,12.46 | 22.38,12.46 21.55,13.3 arc45 19.35,14.21 7.27,14.21 arc-45 5.97,14.74 3.94,16.78 arc-45 3.33,18.24 3.33,42.55 13.1,52.31 v13.65,52.31 | 22.38,12.46 AN1.5 | IC2.15 v13.65,52.31 | 13.57,52.31 v13.65,52.31
  Bottom 0.406: D13.K v13.65,52.31
K6  (via drill 0.8 pad 1.42)
  Top 0.406: AN4.6 133.57,10.93 arc45 131.03,11.99 127.47,11.99 arc45 125.44,11.14 124.84,10.54 arc-45 122.39,9.53 102.84,9.53 arc-45 101.34,10.15 | 101.34,10.15 100.52,10.97 arc45 98.06,11.99 94.47,11.99 arc45 92.41,11.13 91.8,10.52 arc-45 89.39,9.53 53.91,9.53 arc-45 AN2.6 51.68,10.91 arc45 49.09,11.99 45.51,11.99 arc45 43.56,11.18 42.9,10.51 arc-45 40.51,9.53 20.91,9.53 arc-45 AN1.6 18.63,10.94 arc45 16.11,11.99 12.39,11.99 arc45 10.75,11.31 arc-45 9.32,10.72 8.26,10.72 arc-45 6.35,11.51 1.78,16.08 arc-45 1.27,17.31 1.27,43.34 12.78,54.85 v13.65,54.85 | AN3.6 101.34,10.15 | v13.65,54.85 IC2.13 | 13.26,54.85 v13.65,54.85
  Bottom 0.406: D11.K v13.65,54.85
K7  (via drill 0.8 pad 1.42)
  Top 0.406: v15.08,40.32 IC1.16
  Bottom 0.406: 45.16,6.91 12.22,6.91 | 12.22,6.91 arc-45 7.62,8.81 arc-45 4.37,16.66 4.37,29.61 v15.08,40.32 D7.K | 45.16,6.91 94.06,6.91 | 94.06,6.91 123.86,6.91 arc90 AN4.7 | AN3.7 94.06,10.13 94.06,6.91 | AN2.7 45.16,6.91 | AN1.7 12.15,6.98 12.22,6.91
K8  (via drill 0.8 pad 1.42)
  Top 0.254: 90.26,11.84 AN3.8
  Top 0.406: AN4.8 124.16,12.94 110.54,12.94 arc45 108.01,11.89 108,11.88 arc-45 105,10.64 104.26,10.64 arc-45 102.97,11.17 102.2,11.94 arc45 99.79,12.94 92.92,12.94 arc45 90.26,11.84 89.64,11.21 arc-45 88.05,10.56 55.61,10.56 arc-45 54.04,11.21 53.36,11.89 arc45 50.82,12.94 42.31,12.94 | 42.31,12.94 28.75,12.94 arc45 26.15,11.86 arc-45 23.19,10.64 22.22,10.64 arc-45 21.15,11.08 20.41,11.82 arc45 17.71,12.94 9.37,12.94 | 9.37,12.94 7.31,12.94 arc-45 5.67,13.61 2.93,16.36 arc-45 2.3,17.88 2.3,42.94 12.94,53.58 v15.08,53.58 IC2.14 | AN2.8 42.25,12.88 42.31,12.94 | AN1.8 9.23,12.8 9.37,12.94
  Bottom 0.406: v15.08,53.58 D12.K
K9  (via drill 0.8 pad 1.42)  (1 unrouted)
  Top 0.406: AN4.9 110.46,15.83 arc45 107.05,14.42 106.88,14.25 arc-45 106.02,13.89 arc-45 104.58,14.49 arc45 101.33,15.83 AN3.9 arc45 86.89,14.74 arc-45 84.84,13.89 57.17,13.89 arc-45 55.78,14.47 arc45 52.48,15.83 AN2.9 28.54,15.83 arc45 25.14,14.42 24.98,14.27 arc-45 24.07,13.89 arc-45 22.68,14.47 arc45 19.39,15.83 AN1.9 arc-45 6.21,16.41 5.02,17.6 arc-45 4.37,19.18 4.37,42.15 13.26,51.04 v15.08,51.04 IC2.16
  Bottom 0.406: v15.08,51.04 D14.K
LED1  (via drill 0.8 pad 1.42)
  Top 0.305: IC3.31 53.91,45.34 55.96,47.39 66.2,47.39 | v71.52,47.39 66.2,47.39 | 66.2,47.39 T9.1 | K2.2 76.28,49.13 v74.53,47.39
  Bottom 0.305: v74.53,47.39 v71.52,47.39
LED2
  Top 0.305: IC3.30 54.38,44.54 55.72,45.88 73.1,45.88 | 73.1,45.88 76.52,45.88 79.77,49.13 K2.1 | T10.1 73.03,45.96 73.1,45.88
LED3  (via drill 0.8 pad 1.42)
  Top 0.305: IC3.28 60.24,42.94 v60.8,43.5
  Bottom 0.305: JP2.4 v60.8,43.5
N$1
  Top 0.305: IC3.20 48.34,38.26 47.78,37.7 47.78,37.31 47.86,37.23 47.86,37.07
  Top 0.508: C3.2 47.7,36.91 47.86,37.07
N$2
  Top 0.813: 113.19,40.16 113.19,42.47 112.63,42.47 112.63,41.04 111.68,41.04 111.68,41.83 112,41.83 112.08,41.75
N$3  (via drill 0.8 pad 1.42)
  Top 0.61: 106.6,55.41 106.68,55.48 | C1.C+ | IC4.2 v109.86,50.32 | IO2.8 C5.2 91.84,53.26 93.66,55.09 103.66,55.09 104.06,55.48 | R2.2 R3.2 95.49,60.09 99.62,55.96 103.11,55.96 C6.C+
  Top 1.016: 108.35,55.48 113.43,55.48
  Top 1.422: F1.2 132.48,53.66 | 108.35,55.48 109.86,55.48 v109.86,50.32 | v107.31,55.48 108.43,55.48
  Top 1.676: C6.C+ 104.06,55.48 106.68,55.48 v107.31,55.48 108.35,55.48 108.43,55.48 109.86,55.48 C1.C+ | C1.C+ 113.43,55.48 118.46,55.48 D15.C 118.51,55.4 120.25,53.66 132.48,53.66 135.67,50.47 L1.P$1
  Bottom 0.61: F1.2 R28.2 | C12.+ v109.86,50.32 C9.1
  Bottom 1.676: 111.76,55.48 v107.31,55.48 C6.C+
N$4
  Bottom 1.422: F1.1 130.49,59.77 K1.1
N$5
  Top 0.61: D8.K 63.34,55.64 63.98,55.01 T9.3
N$6
  Top 0.61: T10.3 70.8,55.01 70.17,55.64 D9.K
N$7
  Bottom 0.61: R7.2 79.22,10.87 78.34,10 D10.A
N$8
  Top 0.61: R2.1 D8.A
N$9
  Top 0.61: R3.1 D9.A
N$10
  Bottom 0.61: D10.K D20.A
N$11
  Bottom 0.61: D19.K GL1.2
N$12
  Top 0.61: R5.1 R27.2 108.03,45.72 108.58,46.28 IC4.3
N$13
  Top 0.61: C7.1 IC4.5
N$15
  Top 2.54: L1.P$2 127.43,34.47 D16.A 125.86,44.32 T12.2
N$16
  Top 0.61: T12.3 113.21,42.88 IC4.8 111.2,42.88 111.2,40.06 RSENSE.2
N$17  (via drill 0.8 pad 1.42)
  Top 0.305: IC3.29 55.65,43.74 v56.36,44.45
  Bottom 0.305: v56.36,44.45 52.78,40.88 52.78,35 51.51,33.73 45.09,33.73 42.62,36.2 R1.1 32.38,36.2 ISP1.5
N$23
  Bottom 0.61: D20.K D19.A
N$28
  Bottom 0.61: R28.1 136.29,56.59 D17.A
N$33  (via drill 3 pad 1.42)
  other vias: 2.46,57.23
N$34  (via drill 3 pad 1.42)
  other vias: 2.46,4.37
N$35  (via drill 3 pad 1.42)
  other vias: 144.07,4.37
N$36  (via drill 3 pad 1.42)
  other vias: 144.07,57.23
N$51
  Top 0.61: R8.1 | T1.B 20.72,26.2 | R6.2
  Top 1.016: T1.B R8.1 R6.2
N$52
  Top 1.016: T1.C 18.74,28.41 17.78,29.37 R9.2
N$53
  Top 1.016: R6.1 26.92,28.1 T2.C
N$55
  Top 0.61: T2.B R11.2 33.81,26.19 34.53,26.91 R10.1
N$56
  Top 1.016: T3.B R13.1 R12.2
N$57
  Top 1.016: T3.C 51.76,28.41 50.8,29.37 R14.2
N$58
  Top 1.016: R12.1 59.94,28.1 T4.C
N$59
  Top 0.61: T4.B R16.2 66.67,26.19 67.39,26.91 R15.1
N$60
  Top 1.016: T5.B R18.1 R17.2
N$61
  Top 0.61: 91.44,27.06 T5.C
  Top 1.016: T5.C 91.43,28.33 92.39,29.29 R19.2
N$62
  Top 1.016: R17.1 83.33,26.11 T6.C
N$63
  Top 0.61: T6.B R21.2 | R21.2 77.63,28.1 | R20.1 R21.2
N$64
  Top 1.016: T7.B R23.1 R22.2
N$65
  Top 1.016: T7.C 124.45,28.33 125.41,29.29 R24.2
N$66
  Top 1.016: R22.1 116.27,26.11 T8.C
N$67
  Top 0.61: T8.B R26.2 | R26.2 | R26.2 R25.1
TL1
  Top 0.305: SW1.1 SW1.3 38.1,52.86 48.97,52.86 50.74,51.1 IC3.2
TL2
  Top 0.305: SW2.1 SW2.3 48.42,54.69 51.54,51.57 IC3.1
TL3
  Top 0.305: SW3.1 52.7,54.69 | 52.7,54.69 SW3.3 | IC3.32 52.65,46.14 52.63,46.12 52.63,46.2 52.7,46.2 52.7,54.69
ULN1  (via drill 0.8 pad 1.42)
  Top 0.305: IC1.1 24.69,40.32 25.6,39.41 | IC3.17 45.94,39.27 45.96,39.29 45.88,39.37 25.72,39.37 25.6,39.41 | v25.64,39.37 25.6,39.41
  Bottom 0.305: ISP1.3 31.75,39.37 v25.64,39.37
ULN2  (via drill 0.8 pad 1.42)
  Top 0.305: IC3.16 28.2,40.54 v27.7,41.04 27.15,41.59 IC1.2
  Bottom 0.305: v27.7,41.04 28.2,40.54 33.12,40.54 ISP1.1
ULN3  (via drill 0.8 pad 1.42)
  Top 0.305: IC3.15 29.54,41.34 28.02,42.86 IC1.3 21.27,42.86 20.56,42.15 20.56,34.37 21.27,33.66 v25.64,33.66
  Bottom 0.305: ISP1.4 32.38,33.66 v25.64,33.66
ULN4
  Top 0.305: IC3.14 30.01,42.14 28.02,44.13 IC1.4
ULN5
  Top 0.305: IC3.13 30.48,42.94 28.02,45.4 IC1.5
ULN6
  Top 0.305: IC3.12 30.95,43.74 28.02,46.67 IC1.6
ULN7
  Top 0.305: IC3.11 31.42,44.54 28.02,47.94 IC1.7
ULN8
  Top 0.305: IC3.10 31.89,45.34 26.19,51.04 IC2.1
ULN9
  Top 0.305: IC3.9 32.36,46.14 26.19,52.31 IC2.2
ULN10
  Top 0.305: IC3.7 46.74,46.74 46.51,46.51 45.56,46.51 45.01,47.07 32.7,47.07 26.19,53.58 IC2.3
ULN11
  Top 0.305: IC3.8 45.94,47.88 45.88,47.94 33.1,47.94 26.19,54.85 IC2.4

### Text on the board
Top: TOP | NIXIE CLOCK | StavJi | 2016
Bottom: BOT